# EAGLE design ANTBRAIN (EAGLE 9.0.0)
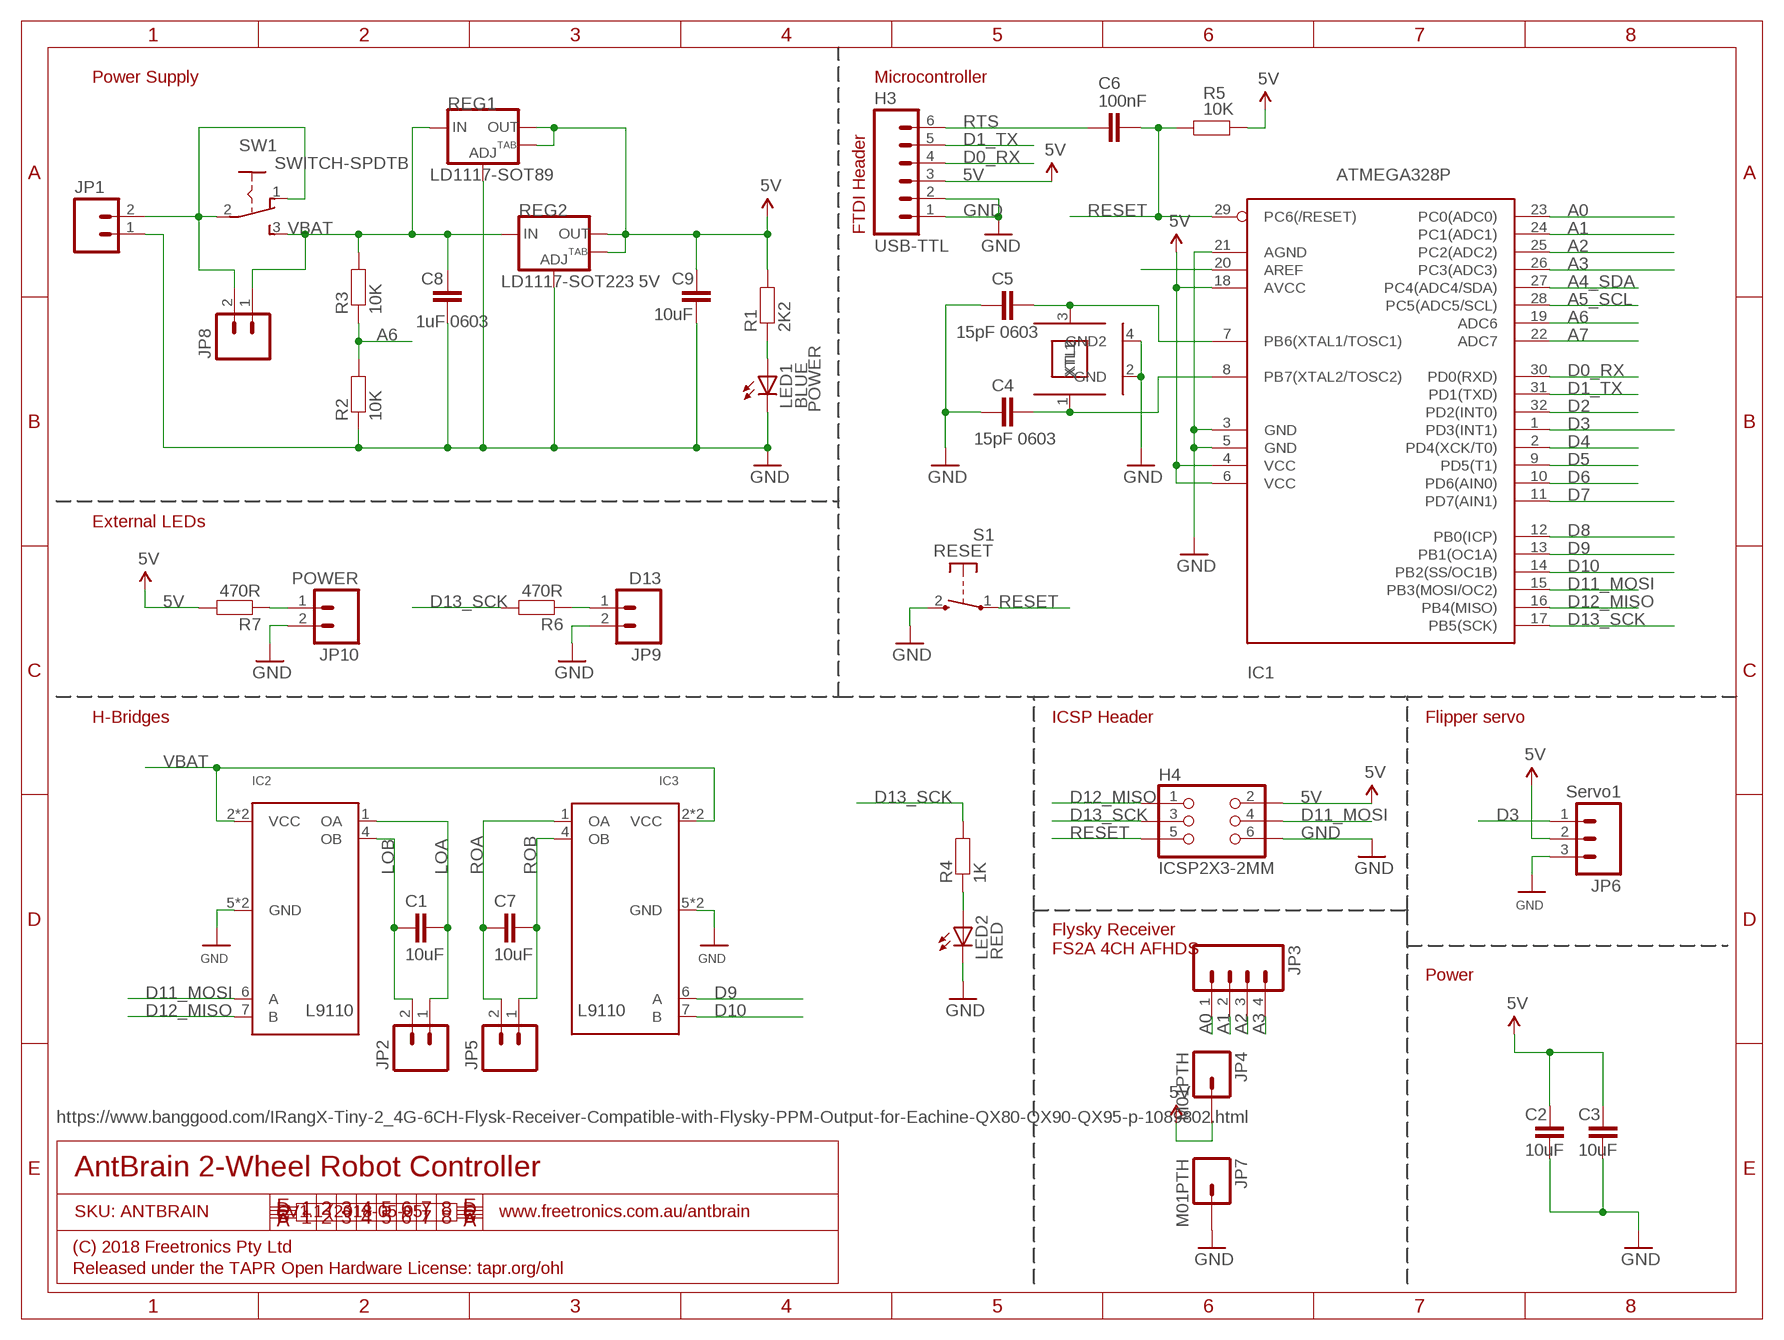
[diagram p0: schematic, sheet 1]

## Parts
C1  10uF  CAP0805  [0805]
C2  10uF  CAP0805  [0805]
C3  10uF  CAP0805  [0805]
C4  15pF 0603  CAP0603  [0603]
C5  15pF 0603  CAP0603  [0603]
C6  100nF  CAP0603  [0603]
C7  10uF  CAP0805  [0805]
C8  1uF 0603  CAP0603  [0603]
C9  10uF  CAP0805  [0805]
H3  USB-TTL  M06SIP  [1X06]
H4  ICSP2X3-2MM  [M2X3-2MM]
IC1  ATMEGA328P  AVR-MEGA8-AI  [TQFP32-08]
IC2  L9110SO8  [SO08]
IC3  L9110SO8  [SO08]
JP1  M02PTH  [1X02]
JP2  M02PTH  [1X02]
JP3  M04PTH  [1X04]
JP4  M01PTH  [1X01]
JP5  M02PTH  [1X02]
JP6  Servo1  M03PTH  [1X03]
JP7  M01PTH  [1X01]
JP8  M022MM  [M02-2MM]
JP9  D13  M022MM  [M02-2MM]
JP10  POWER  M022MM  [M02-2MM]
LED1  BLUE  LED0603  [LED-0603]
LED2  RED  LED0603  [LED-0603]
R1  2K2  RESISTOR0603  [0603]
R2  10K  RESISTOR0603  [0603]
R3  10K  RESISTOR0603  [0603]
R4  1K  RESISTOR0603  [0603]
R5  10K  RESISTOR0603  [0603]
R6  470R  RESISTOR0603  [0603]
R7  470R  RESISTOR0603  [0603]
REG1  LD1117-SOT89  V_REG_LM1117SOT89  [SOT89]
REG2  LD1117-SOT223 5V  V_REG_LM1117SOT223  [SOT223]
S1  RESET  TAC_SWITCH_2PIN  [TACTILE_SWITCH_SMD_2PIN_TINY]
SW1  SWITCH-SPDTB  [SPDT-2.5MM]
XTL1  16MHz  CRYSTAL-GND3X2  [CRYSTAL-SMD-3X2]

## Nets
5V: C2.1 C3.1 C9.1 H3.3 H4.2 IC1.4(VCC) IC1.6(VCC) IC1.18(AVCC) JP4.1 JP6.2 R1.2 R5.2 R7.2 REG1.2(OUT) REG1.4(OUT) REG2.2(OUT) REG2.4(OUT)
A0: IC1.23(PC0(ADC0)) JP3.1
A1: IC1.24(PC1(ADC1)) JP3.2
A2: IC1.25(PC2(ADC2)) JP3.3
A3: IC1.26(PC3(ADC3)) JP3.4
A4_SDA: IC1.27(PC4(ADC4/SDA))
A5_SCL: IC1.28(PC5(ADC5/SCL))
A6: IC1.19(ADC6) R2.2 R3.1
A7: IC1.22(ADC7)
AREF: IC1.20(AREF)
D0_RX: H3.4 IC1.30(PD0(RXD))
D1_TX: H3.5 IC1.31(PD1(TXD))
D2: IC1.32(PD2(INT0))
D3: IC1.1(PD3(INT1)) JP6.1
D4: IC1.2(PD4(XCK/T0))
D5: IC1.9(PD5(T1))
D6: IC1.10(PD6(AIN0))
D7: IC1.11(PD7(AIN1))
D8: IC1.12(PB0(ICP))
D9: IC1.13(PB1(OC1A)) IC3.6(A)
D10: IC1.14(PB2(SS/OC1B)) IC3.7(B)
D11_MOSI: H4.4 IC1.15(PB3(MOSI/OC2)) IC2.6(A)
D12_MISO: H4.1 IC1.16(PB4(MISO)) IC2.7(B)
D13_SCK: H4.3 IC1.17(PB5(SCK)) R4.2 R6.2
GND: C2.2 C3.2 C4.1 C5.1 C8.2 C9.2 H3.1 H3.2 H4.6 IC1.3(GND) IC1.5(GND) IC1.21(AGND) IC2.5(GND) IC2.8(GND) IC3.5(GND) IC3.8(GND) JP1.1 JP6.3 JP7.1 JP9.2 JP10.2 LED1.C LED2.C R2.1 REG1.1(ADJ) REG2.1(ADJ) S1.2(S) XTL1.2(GND) XTL1.4(GND2)
LOA: C1.1 IC2.1(OA) JP2.1
LOB: C1.2 IC2.4(OB) JP2.2
N$5: LED2.A R4.1
N$6: JP10.1 R7.1
N$8: JP9.1 R6.1
N$9: JP1.2 JP8.2 SW1.1 SW1.2
N$11: C5.2 IC1.7(PB6(XTAL1/TOSC1)) XTL1.3(XTL2)
N$12: C4.2 IC1.8(PB7(XTAL2/TOSC2)) XTL1.1(XTL1)
N$14: LED1.A R1.1
RESET: C6.2 H4.5 IC1.29(PC6(/RESET)) R5.1 S1.1(P)
ROA: C7.2 IC3.1(OA) JP5.2
ROB: C7.1 IC3.4(OB) JP5.1
RTS: C6.1 H3.6
VBAT: C8.1 IC2.2(VCC) IC2.3(VCC) IC3.2(VCC) IC3.3(VCC) JP8.1 R3.2 REG1.3(IN) REG2.3(IN) SW1.3

## Notes on the sheet
- Power Supply | Microcontroller
- FTDI Header
- POWER
- External LEDs
- H-Bridges | ICSP Header | Flipper servo
- Flysky Receiver
  FS2A 4CH AFHDS
- Power
- https://www.banggood.com/IRangX-Tiny-2_4G-6CH-Flysk-Receiver-Compatible-with-Flysky-PPM-Output-for-Eachine-QX80-QX90-QX95-p-1089802.html
- AntBrain 2-Wheel Robot Controller
- SKU: ANTBRAIN | V1.1 (2018-05-05) | www.freetronics.com.au/antbrain
- (C) 2018 Freetronics Pty Ltd
- Released under the TAPR Open Hardware License: tapr.org/ohl

## Library data of the parts
C1-C3 C7 C9 = freetronics-jon:CAP: Capacitor Standard 0603 ceramic capacitor, and 0.1" leaded capacitor.
C4-C6 = freetronics-master-v1.1:CAP: Capacitor Standard 0603 ceramic capacitor, and 0.1" leaded capacitor.
C8 = freetronics:CAP: Capacitor Standard 0603 ceramic capacitor, and 0.1" leaded capacitor.
H3 = freetronics:M06: Header 6 Standard 6-pin 0.1" header. Use with straight break away headers (SKU : PRT-00116), right angle break away headers (PRT-00553), swiss pins (PRT-00743), machine pins (PRT-00117), and female headers (PRT-00115). Molex polarized connector foot print use with SKU : PRT-08094 with associated crimp pins and housings. NOTES ON THE VARIANTS LOCK and LOCK_LONGPADS... This footprint was designed to help hold the alignment of a through-hole component (i.e. 6-pin header) while soldering it into place. You may notice that each hole has been shifted either up or down by 0.005 of an inch from it's more standard position (which is a perfectly straight line). This slight alteration caused the pins (the squares in the middle) to touch the edges of the holes. Because they are alternating, it causes a "brace" to hold the component in place. 0.005 has proven to be the perfect amount of "off-center" position when using our standard breakaway headers. Although looks a little odd when you look at the bare footprint, once you have a header in there, the alteration is very hard to notice. Also, if you push a header all the way into place, it is covered up entirely on the bottom side. This idea of altering the position of holes to aid alignment will be further integrated into the Sparkfun Library for other footprints. It can help hold any component with 3 or more connection pins.
H4 = freetronics-jon:ICSP
IC1 = freetronics-master-v1.1:AVR-MEGA8: MICROCONTROLLER 8 Kbytes FLASH 1 kbytes SRAM 512 bytes EEPROM USART 6-channel 10 bit ADC 2-channel 8 bit ADC
IC2 IC3 = freetronics-jon:L9110
JP1 JP2 JP5 JP8-JP10 = freetronics-jon:M02: Header 2 Standard 2-pin 0.1" header. Use with straight break away headers (SKU : PRT-00116), right angle break away headers (PRT-00553), swiss pins (PRT-00743), machine pins (PRT-00117), and female headers (PRT-00115). Molex polarized connector foot print use with SKU : PRT-08233 with associated crimp pins and housings.
JP3 = freetronics-jon:M04: Header 4 Standard 4-pin 0.1" header. Use with straight break away headers (SKU : PRT-00116), right angle break away headers (PRT-00553), swiss pins (PRT-00743), machine pins (PRT-00117), and female headers (PRT-00115). Molex polarized connector foot print use with SKU : PRT-08231 with associated crimp pins and housings. 1MM SMD Version SKU: PRT-10208
JP4 JP7 = freetronics-jon:M01: Header 1 Standard 1-pin 0.1" header. Use with straight break away headers (SKU : PRT-00116), right angle break away headers (PRT-00553), swiss pins (PRT-00743), machine pins (PRT-00117), and female headers (PRT-00115).
JP6 = freetronics-master-v1.1:M03: Header 3 Standard 3-pin 0.1" header. Use with straight break away headers (SKU : PRT-00116), right angle break away headers (PRT-00553), swiss pins (PRT-00743), machine pins (PRT-00117), and female headers (PRT-00115). Molex polarized connector foot print use with SKU : PRT-08232 with associated crimp pins and housings.
LED1 LED2 = freetronics-jon:LED: LEDs Standard schematic elements and footprints for 5mm, 3mm, 1206, and 0603 sized LEDs. 5mm - Spark Fun Electronics SKU : COM-00529 (and others)
R1-R4 R6 R7 = freetronics-jon:RESISTOR: Resistor Basic schematic elements and footprints for 0603, 1206, and PTH 1/10th watt (small) resistors.
R5 = freetronics-master-v1.1:RESISTOR: Resistor Basic schematic elements and footprints for 0603, 1206, and PTH 1/10th watt (small) resistors.
REG1 REG2 = freetronics:V_REG_LM1117: Voltage Regulator LD1117 Adjustable low-dropout voltage regulator available in SOT89 and SOT223 SMT packages.
S1 = freetronics-jon:TAC_SWITCH_2PIN: Momentary Tactile Switch - 2 pin
SW1 = freetronics-jon:SWITCH-SPDT
XTL1 = freetronics-jon:CRYSTAL-GND

## Board
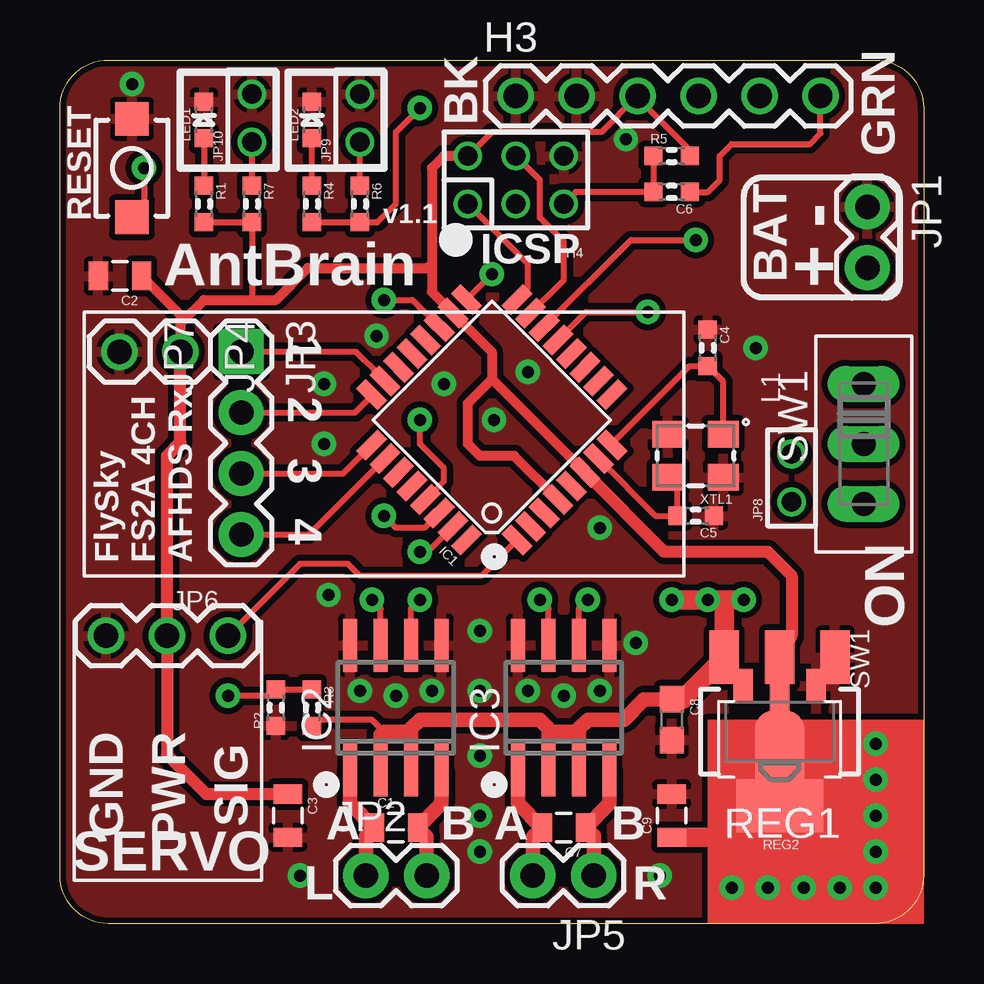
[diagram p1: board, top side]
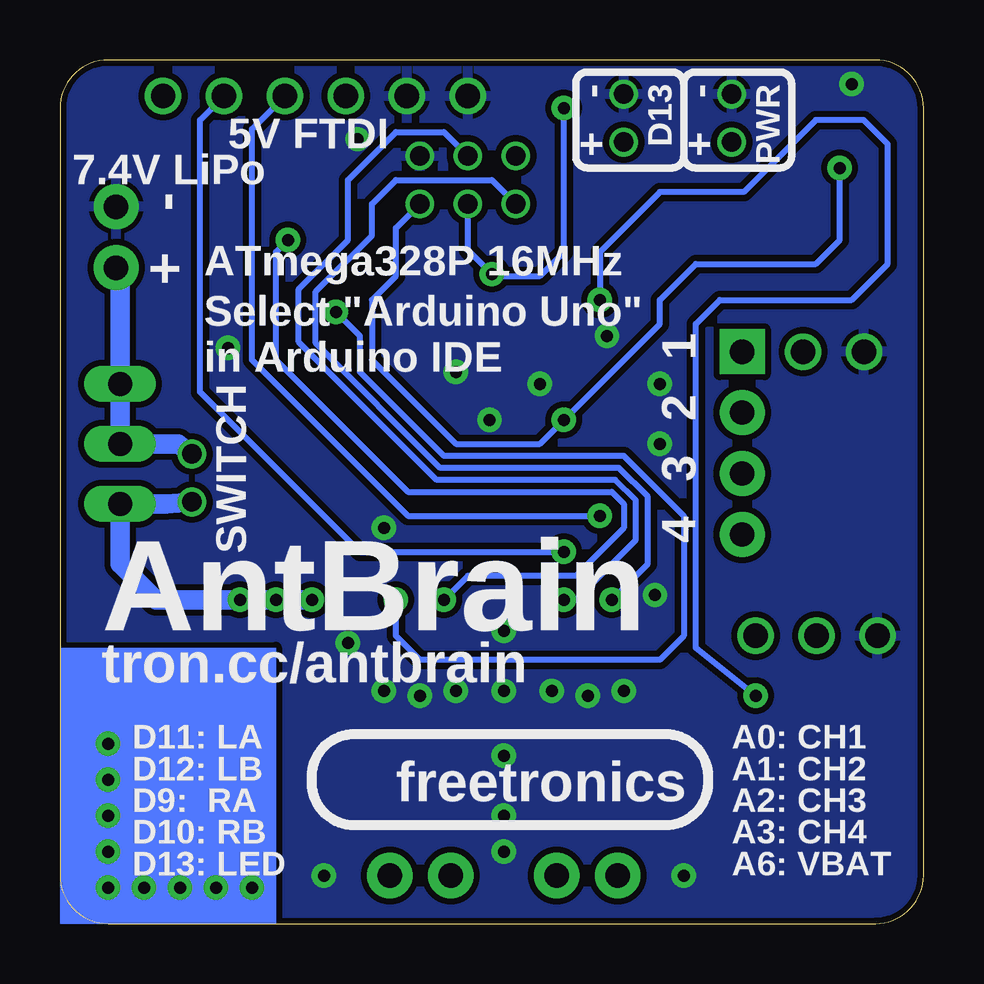
[diagram p2: board, bottom side, seen from below]

Size 36 x 36 mm. Coordinates in mm from the lower left corner, seen from the top.
Outline: 0,34 arc-90 2,36 34,36 arc-90 36,34 36,2 arc-90 34,0 2,0 arc-90 0,2 0,34
Copper layers (1*16): Top 0.035mm / dielectric 1.5mm / Bottom 0.035mm
Design rules "default *": minimum track width 8mil, minimum drill 0.4mm, track to track 8mil, track to pad 8mil, pad to pad 8mil, via to via 8mil, smd to smd 8mil, copper to edge 10mil, drill to drill 8mil, minimum pad ring 8mil, minimum via ring 10mil, stop-mask expansion 3mil, vias tented up to drill 25mil, thermal gap 8mil

### Footprints (pad centres in the part's own frame; a part is rotated, then mirrored left to right if it is on the bottom)
0805 = smd 0.8 x 1.2: 1 -0.9,0; 2 0.9,0
0603 = smd 0.762 x 0.762: 1 -0.762,0; 2 0.762,0
0603' = smd 1.1 x 1: 1 -0.85,0; 2 0.85,0
1X06 = drill 1.016: 1 0,0; 2 2.54,0; 3 5.08,0; 4 7.62,0; 5 10.16,0; 6 12.7,0
M2X3-2MM = drill 0.8: 1 2,1; 2 2,-1; 3 0,1; 4 0,-1; 5 -2,1; 6 -2,-1
TQFP32-08 = smd 1.27 x 0.559: 1 -4.293,2.8; 2 -4.293,2; 3 -4.293,1.2; 4 -4.293,0.4; 5 -4.293,-0.4; 6 -4.293,-1.2; 7 -4.293,-2; 8 -4.293,-2.8; 17 4.293,-2.8; 18 4.293,-2; 19 4.293,-1.2; 20 4.293,-0.4; 21 4.293,0.4; 22 4.293,1.2; 23 4.293,2; 24 4.293,2.8 | smd 0.559 x 1.27: 9 -2.8,-4.293; 10 -2,-4.293; 11 -1.2,-4.293; 12 -0.4,-4.293; 13 0.4,-4.293; 14 1.2,-4.293; 15 2,-4.293; 16 2.8,-4.293; 25 2.8,4.293; 26 2,4.293; 27 1.2,4.293; 28 0.4,4.293; 29 -0.4,4.293; 30 -1.2,4.293; 31 -2,4.293; 32 -2.8,4.293
SO08 = smd 0.6 x 2.2: 1 -1.905,-2.6; 2 -0.635,-2.6; 3 0.635,-2.6; 4 1.905,-2.6; 5 1.905,2.6; 6 0.635,2.6; 7 -0.635,2.6; 8 -1.905,2.6
1X02 = drill 1.016 pad 1.88: 1 0,0; 2 2.54,0
1X04 = drill 1.016 pad 1.88 square: 1 0,0 | drill 1.016 pad 1.88: 2 2.54,0; 3 5.08,0; 4 7.62,0
1X01 = drill 1.016: 1 0,0
1X03 = drill 1.016: 1 0,0; 2 2.54,0; 3 5.08,0
M02-2MM = drill 0.8: 1 0.08,0; 2 2.08,0
LED-0603 = smd 0.762 x 0.762: A -0.762,0; C 0.762,0
SOT89 = smd 0.8 x 1.4: 1 -1.524,-1.905; 3 1.524,-1.905 | smd 0.8 x 1.9: 2 0,-1.651 | smd 2.032 x 3.65: 4 0,0.94
SOT223 = smd 1.219 x 2.235: 1 -2.311,-3.099; 2 0,-3.099; 3 2.311,-3.099 | smd 3.6 x 2.2: 4 0,3.099
TACTILE_SWITCH_SMD_2PIN_TINY = smd 1.4 x 1.4: 1 -2.05,0; 2 2.05,0
SPDT-2.5MM = drill 1 long: 1 -2.5,0; 2 0,0; 3 2.5,0
CRYSTAL-SMD-3X2 = smd 1.3 x 1.1: 1 -1.15,-0.9; 2 1.15,-0.9; 3 1.15,0.9; 4 -1.15,0.9

### Placement (x,y rotation side)
C1  14,4 0 top
C2  2.5,27 180 top
C3  9.5,4.5 270 top
C4  27,24 270 top
C5  26.5,17 180 top
C6  25.5,30.5 180 top
C7  21,4 180 top
C8  1uF 0603  [0603']  25.5,8.5 270 top
C9  25.5,4.5 90 top
H3  19,34.5 0 top
H4  19,31 180 top
IC1  18,21 135 top
IC2  14,9 0 top
IC3  21,9 0 top
JP1  33.66,29.88 270 top
JP2  12.75,2 0 top
JP3  7.56,23.84 270 top
JP4  5.02,23.84 270 top
JP5  22.25,2 180 top
JP6  7,12 180 top
JP7  2.48,23.84 270 top
JP8  30.5,17.5 90 top
JP9  12.5,32.5 90 top
JP10  8,32.5 90 top
LED1  6,33.5 90 top
LED2  10.5,33.5 90 top
R1  6,30 270 top
R2  9,9 90 top
R3  10.5,9 270 top
R4  10.5,30 270 top
R5  25.5,32 0 top
R6  12.5,30 270 top
R7  8,30 270 top
REG1  30,8 180 top
REG2  30,8 180 top
S1  3,31.5 90 top
SW1  33.5,20 270 top
XTL1  26.5,19.5 180 top

### Tracks (layer width: path | path; a pad name or v marks a point on that pad's centre or on a via)
5V  (via drill 0.5)
  Top 0.254: v29.5,1.5 30,2 REG2.4 | H3.3 24.04,34.46 | 24.04,34.46 22.58,33 18,33 H4.2 | R5.2 26.26,32.24 24.04,34.46 | R1.2 R7.2 8,26 | REG2.2 REG1.2 30,9.5 | REG1.4 30,5.5
  Top 0.406: 18,22.7 IC1.6 | 18,22.7 18,23.83 IC1.18 15.5,26.33 15.5,27.5 | 5.02,25.02 6,26 8,26 9,26 10.33,27.33 15.33,27.33 15.5,27.5 | 5.02,25.02 JP4.1 | IC1.4 18.93,19.5 17.5,19.5 17,20 17,21.7 18,22.7 | H4.2 16,32 15.5,31.5 15.5,27.5 | C2.1 5.02,25.38 5.02,25.02
  Top 0.508: REG2.2 30.5,12 30.5,14.5 29.5,15.5 25.2,15.5 IC1.6 | C3.1 6.1,5.4 4.46,7.04 JP6.2 4.46,19.5 5.02,20.06 JP4.1
  Top 0.61: 30,9.5 30,5.5 REG2.4
  Top 0.813: REG2.4 28.7,3.6 C9.1
  Bottom 0.254: v28,1.5 v29.5,1.5 v31,1.5 v32.5,1.5 v34,1.5 v34,3 v34,4.5 v34,6 v34,7.5
A0
  Top 0.254: IC1.23 13.09,23.09 12.67,23.5 12.33,23.84 JP3.1 7.66,23.84
A1
  Top 0.254: IC1.24 12.98,21.98 12.3,21.3 JP3.2
A2
  Top 0.254: IC1.25 11.8,18.76 JP3.3
A3
  Top 0.254: JP3.4 10.39,16.22 IC1.26
A6  (via drill 0.5)
  Top 0.254: R3.1 R2.2 8.74,9.5 v7,9.5 | v13.5,26 14.7,26 IC1.19
  Bottom 0.254: v7,9.5 9.5,11.5 9.5,25 8.5,26 3,26 1.5,27.5 1.5,32.5 2.5,33.5 4.5,33.5 7.5,30.5 11,30.5 13.5,28 v13.5,26
D0_RX  (via drill 0.5)
  Top 0.254: IC1.30 15.2,16.5 14,16.5 v13.5,17
  Bottom 0.254: v13.5,17 21.5,17 28,23.5 28,33.12 H3.4
D1_TX  (via drill 0.5)
  Top 0.254: IC1.31 15.33,15.5 v15,15.5
  Bottom 0.254: v15,15.5 23.5,15.5 30.16,22.16 30.16,33.5 H3.5
D3
  Top 0.254: IC1.1 17.57,14.5 12.5,14.5 12,15 10,15 JP6.1
D9  (via drill 0.5)
  Top 0.254: IC1.13 21.93,25.5 v24.5,25.5 | IC3.6 21.64,13.13 v22,13.5
  Bottom 0.254: v24.5,25.5 23.5,24.5 23.5,23 20,19.5 12.5,19.5 10,17 10,12 11,11 21,11 22,12 v22,13.5
D10  (via drill 0.5)
  Top 0.254: IC3.7 20.36,13.13 v20,13.5 | IC1.14 23.8,28.5 v26.5,28.5
  Bottom 0.254: v26.5,28.5 27,28 27,23.5 21.5,18 13,18 12.5,17.5 12.5,16.5 14.5,14.5 19,14.5 v20,13.5
D11_MOSI  (via drill 0.5)
  Top 0.254: IC1.15 21,26.83 21,28.43 20,29.43 20,31 H4.4 | IC2.6 14.63,13.13 v15,13.5
  Bottom 0.254: v15,13.5 14.5,13.5 12,16 12,17.65 12.85,18.5 20.29,18.5 26.04,24.25 26.04,26.46 24,28.5 24,31 22,33 20,33 H4.4
D12_MISO  (via drill 0.5)
  Top 0.254: IC1.16 19.05,26.05 19.5,26.5 19.5,27.5 H4.1 | IC2.7 13.37,13.13 v13,13.5
  Bottom 0.254: v13,13.5 11.5,15 11.5,17.79 12.71,19 20.15,19 25.33,24.19 25.33,26.35 24.09,27.59 24,27.68 23,28.68 23,30 22,31 18,31 H4.1
D13_SCK  (via drill 0.5)
  Top 0.254: IC1.17 v18,27.07 | R4.2 R6.2 13.24,29.24 14,30 14,33 v15,34
  Bottom 0.254: H4.3 19,28.07 v18,27.07 17.93,27 16,27 15,28 v15,34
GND  (via drill 0.5)
  Top 0.254: REG1.1 31.52,10.31 REG2.1
  other vias: 3,35 17.5,4.5 17.5,7 17.5,3 10,2 25,2 12.5,9.7 15.5,9.7 19.5,9.7 22.5,9.7 29,24 14,9.5 21,9.5 16,22.5 13.2,24.5 19.5,23 18.1,21 11,22.5 23.6,32.7 17.5,9.7 11.2,13.7 24,11.7 17.5,12.2 22.5,16.5 11,20
  pour Top (isolate 0.254): 2,36 34,36 arc-90 36,34 36,2 arc-90 34,0 2,0 arc-90 0,2 0,34 arc-90
  pour Bottom (isolate 0.254): 2,36 34,36 arc-90 36,34 36,2 arc-90 34,0 2,0 arc-90 0,2 0,34 arc-90
LOA
  Top 0.61: IC2.1 12.1,5 C1.1 12.75,3.65 JP2.1
LOB
  Top 0.61: IC2.4 15.9,5 C1.2 15.29,3.61 JP2.2
N$5
  Top 0.254: R4.1 LED2.A
N$6
  Top 0.254: R7.1 JP10.1
N$8
  Top 0.254: R6.1 JP9.1
N$9
  Bottom 0.813: JP1.2 33.5,27.18 SW1.1 SW1.2 31.08,20 JP8.2
N$11
  Top 0.254: IC1.7 24.83,17 C5.2 25.74,18.21 XTL1.3
N$12
  Top 0.254: IC1.8 23.02,20.02 26.24,23.24 C4.2 27.65,22.59 XTL1.1
N$14
  Top 0.254: LED1.A R1.1
RESET  (via drill 0.5)
  Top 0.254: IC1.29 16,18.43 16,19 15,20 v15,21 | R5.1 C6.2 21.5,30.5 H4.5 | v3.5,31.5 3.5,29.95 S1.1
  Bottom 0.254: H4.5 22,29 22,27 23,26 23,23.5 19.5,20 16,20 v15,21 11,25 11,26 9.5,27.5 4.5,27.5 3.5,28.5 v3.5,31.5
ROA
  Top 0.61: JP5.2 19.71,3.61 C7.2 19.09,5 IC3.1
ROB
  Top 0.61: IC3.4 22.91,5 C7.1 22.25,3.65 JP5.1
RTS
  Top 0.254: H3.6 31.7,32.94 31.26,32.5 28,32.5 27.5,32 27.5,31 27,30.5 C6.1
VBAT  (via drill 0.5)
  Top 0.254: 13.37,7.87 13.37,8.13 13,8.5 10.76,8.5 R3.2 | REG1.3 28.48,10.31 REG2.3
  Top 0.61: REG2.3 27.69,11.81 | IC3.3 21.64,8.13 | 21.64,8.13 22,8.5 23.5,8.5 24.35,9.35 C8.1 | IC3.2 20.36,8 | 20.36,8 20.36,8.13 20,8.5 15,8.5 14.63,8.13 14.63,8 | IC2.3 14.63,8 | 21.64,8.13 21.5,8 20.36,8 | IC2.2 13.37,7.87 13.5,8 14.63,8
  Top 0.813: C8.1 25.94,9.35 REG2.3 27.69,13.31 27.5,13.5 | v28.5,13.5 27.5,13.5 | 27.5,13.5 v27,13.5 v25.5,13.5
  Bottom 0.813: v25.5,13.5 32,13.5 33.5,15 SW1.3 31.58,17.5 JP8.1
(copper drawn outside any net)
  shapes: Bottom area x1, Top area x1

### Text on the board
tPlace: BK | RESET | GRN | v1.1 | BAT | - | ICSP | AntBrain | + | 1 | 2 | 3 | 4 | FlySky / FS2A 4CH / AFHDS Rx | ON | GND | PWR | SIG | A | B | A | B | SERVO | L | R
bPlace: PWR | - | D13 | - | + | + | 5V FTDI | 7.4V LiPo | - | + | ATmega328P 16MHz | 1 | Select "Arduino Uno" / in Arduino IDE | SWITCH | 2 | 3 | 4 | AntBrain | tron.cc/antbrain | freetronics | A0: CH1 / A1: CH2 / A2: CH3 / A3: CH4 / A6: VBAT | D11: LA / D12: LB / D9: RA / D10: RB / D13: LED
tNames: L1 | SW1